# Altium schematic sheet MT8365_CONN.SchDoc
size A3; SheetNumber: 8; SheetTotal: 35
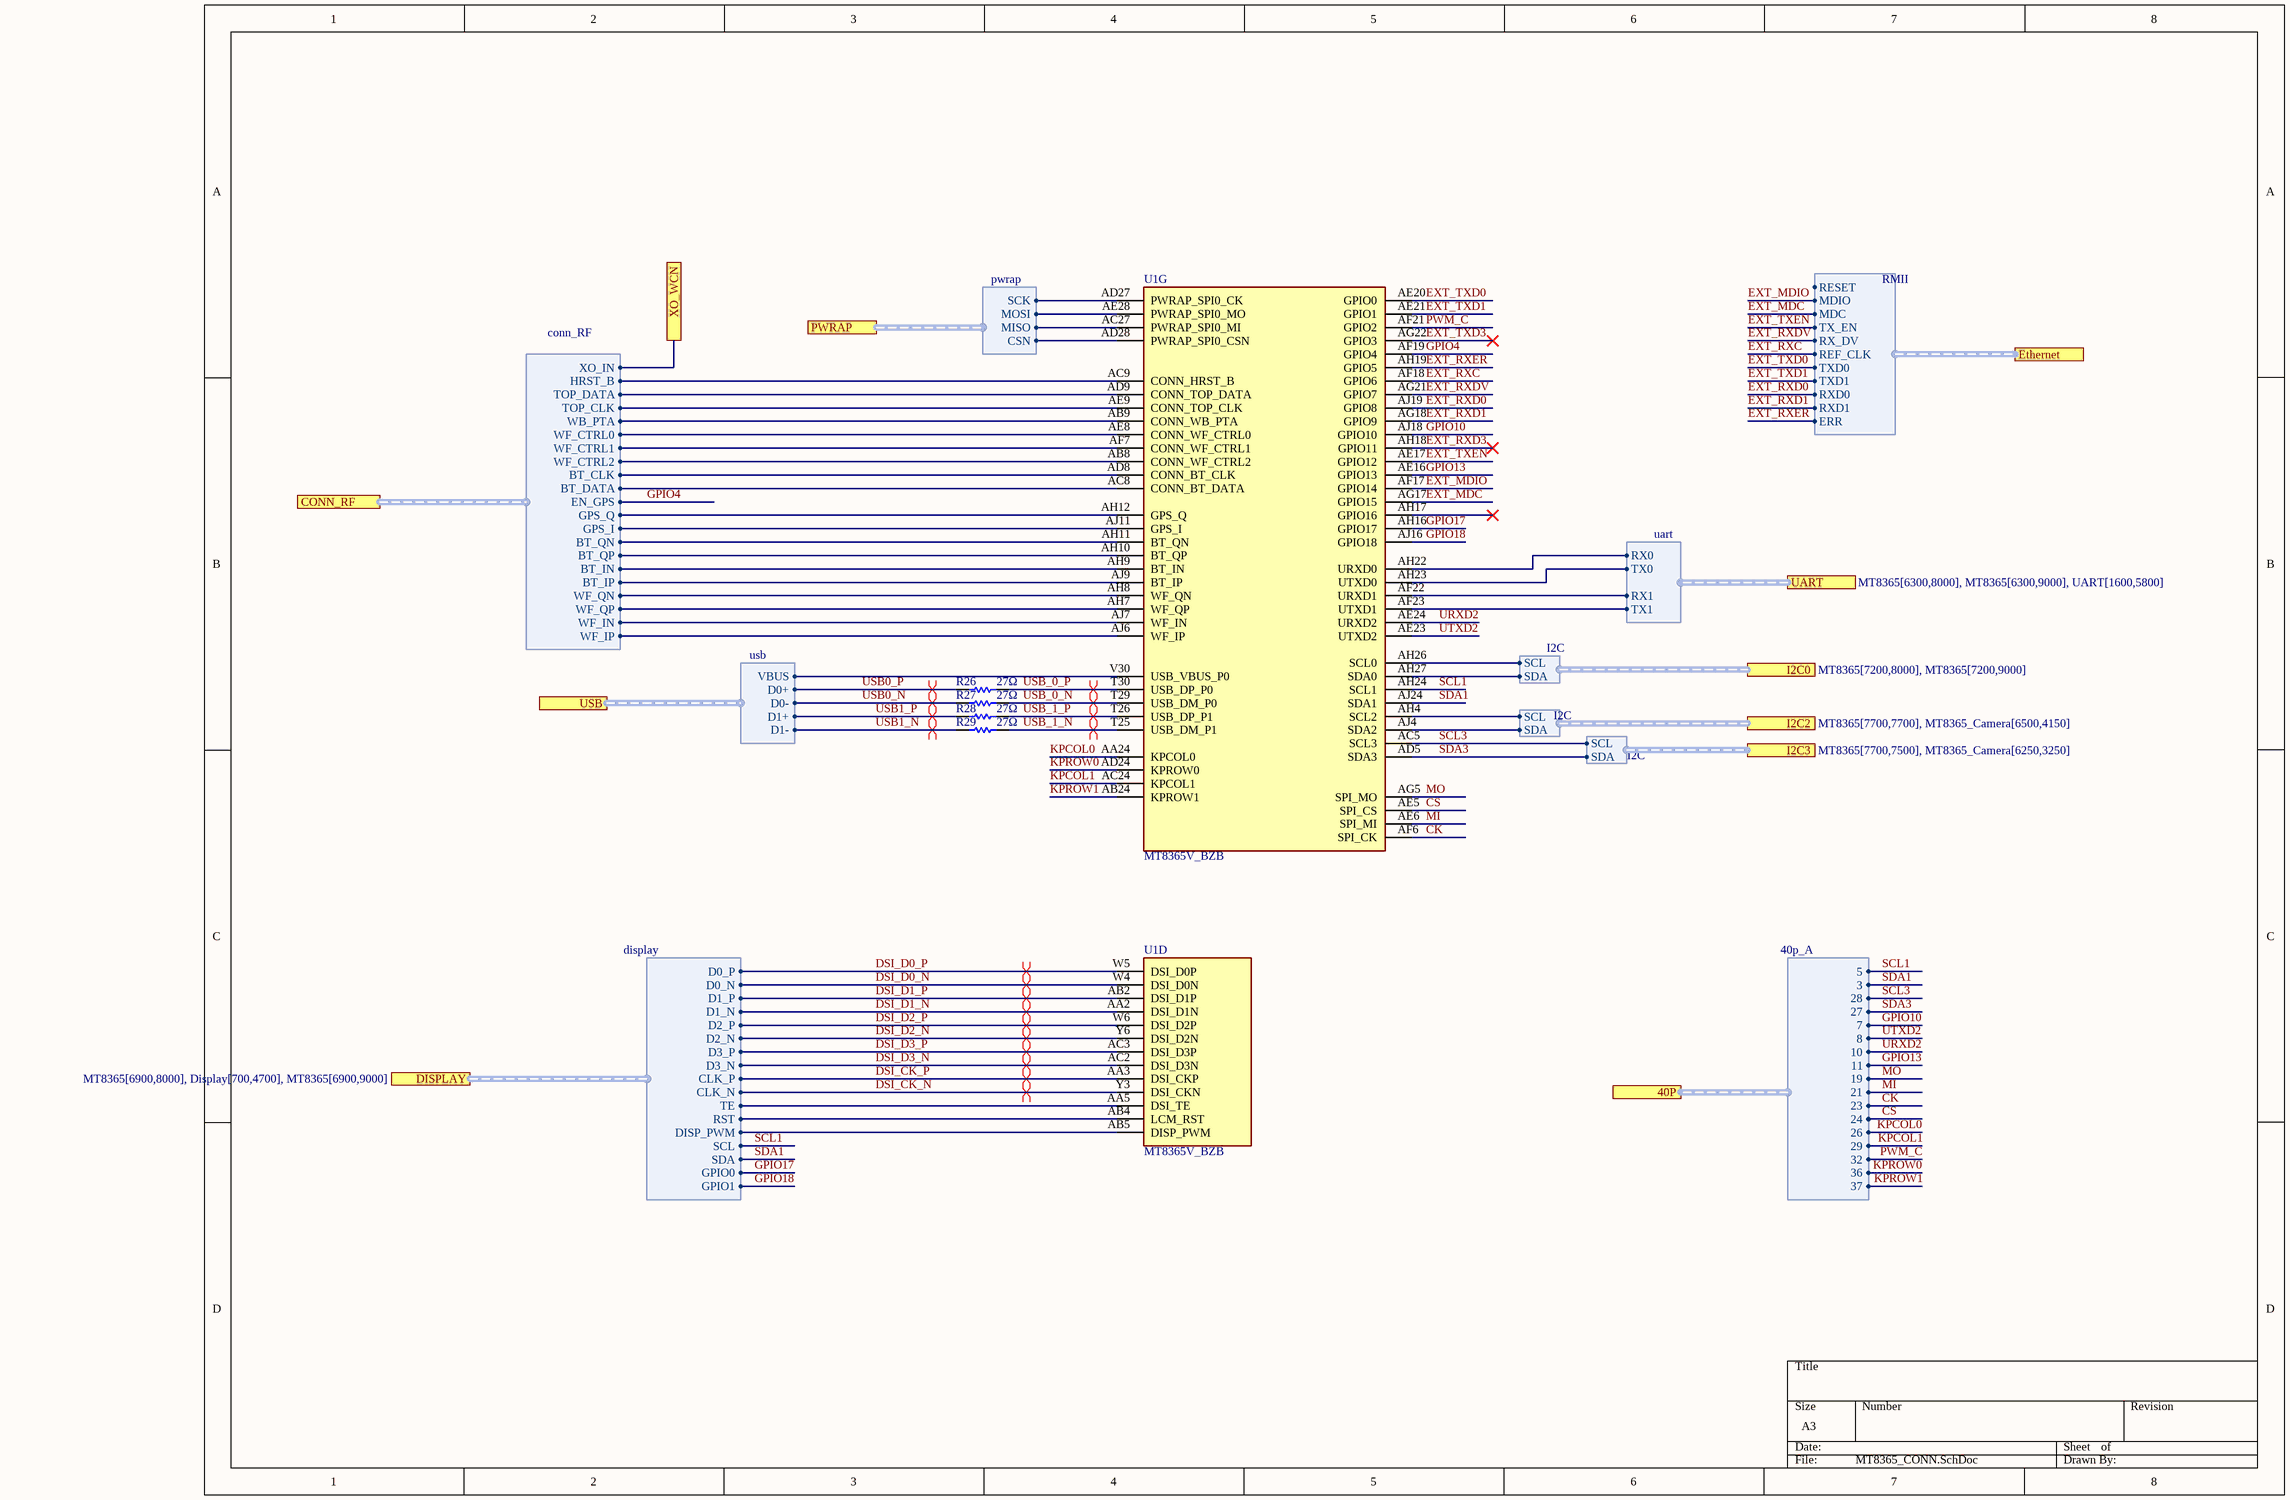
[diagram p0: MT8365_CONN.SchDoc]

## Parts
(Parts that share a designator on the sheet are numbered #1, #2 ... from top to bottom, then left to right.)
R26  value 27Ω  [R0603]  (hidden comment: R0603)
R27  value 27Ω  [R0603]  (hidden comment: R0603)
R28  value 27Ω  [R0603]  (hidden comment: R0603)
R29  value 27Ω  [R0603]  (hidden comment: R0603)
U1#1  MT8365V_BZB  [BGA633C40P30X29_1220X1180X90]  (part G of 10)
U1#2  MT8365V_BZB  [BGA633C40P30X29_1220X1180X90]  (part D of 11)

## Ports
40P (harness 40p_A, see MT8365[7500,8000], GPIOs[500,5200], MT8365[4600,3000], MT8365[7500,8900], MT8365[10000,5500], MT8365_AUD[3500,5200], MT8365_eMMC[8900,5600]), CONN_RF (harness conn_RF, see MT8365[5700,8000], MT6631[10400,3000], MT8365[5700,9000]), DISPLAY (harness display, see MT8365[6900,8000], Display[700,4700], MT8365[6900,9000]), Ethernet (harness RMII, see MT8365[6000,8000], MT8365[6000,9000], RTL8201F[9500,2400]), I2C0 (harness I2C, see MT8365[7200,8000], MT8365[7200,9000]), I2C2 (harness I2C, see MT8365[7700,7700], MT8365_Camera[6500,4150]), I2C3 (harness I2C, see MT8365[7700,7500], MT8365_Camera[6250,3250]), PWRAP (harness pwrap, see MT8365[5500,8000], Control_Interface[3900,4400], MT8365[5500,9000], Power[9100,9000]), UART (harness uart, see MT8365[6300,8000], MT8365[6300,9000], UART[1600,5800]), USB (harness usb, see MT8365[6600,8000], MT8365[6600,9000], USB[700,4700]), XO_WCN (see MT8365[7700,7300], MT8365_Other[3700,4800])

## Harnesses
pwrap: SCK, MOSI, MISO, CSN
conn_RF: XO_IN, HRST_B, TOP_DATA, TOP_CLK, WB_PTA, WF_CTRL0, WF_CTRL1, WF_CTRL2, BT_CLK, BT_DATA, GPS_Q, GPS_I, BT_QN, BT_QP, BT_IN, BT_IP, WF_QN, WF_QP, WF_IN, WF_IP, EN_GPS
RMII: MDIO, MDC, TX_EN, RX_DV, REF_CLK, TXD0, TXD1, RXD0, RXD1, RESET, ERR
uart: TX0, RX0, TX1, RX1
usb: D0+, D0-, D1+, D1-, VBUS
I2C: SCL, SDA
display: D0_P, D0_N, D1_P, D1_N, D2_P, D2_N, D3_P, D3_N, CLK_P, CLK_N, TE, RST, DISP_PWM, SCL, SDA, GPIO0, GPIO1
40p_A: 7, 8, 10, 11, 19, 21, 23, 24, 26, 29, 32, 36, 37, 5, 3, 28, 27

## Nets
CK: U1#1.AF6(SPI_CK) ; port 40P.23
CS: U1#1.AE5(SPI_CS) ; port 40P.24
DSI_CK_N: U1#2.Y3(DSI_CKN) ; port DISPLAY.CLK_N
DSI_CK_P: U1#2.AA3(DSI_CKP) ; port DISPLAY.CLK_P
DSI_D0_N: U1#2.W4(DSI_D0N) ; port DISPLAY.D0_N
DSI_D0_P: U1#2.W5(DSI_D0P) ; port DISPLAY.D0_P
DSI_D1_N: U1#2.AA2(DSI_D1N) ; port DISPLAY.D1_N
DSI_D1_P: U1#2.AB2(DSI_D1P) ; port DISPLAY.D1_P
DSI_D2_N: U1#2.Y6(DSI_D2N) ; port DISPLAY.D2_N
DSI_D2_P: U1#2.W6(DSI_D2P) ; port DISPLAY.D2_P
DSI_D3_N: U1#2.AC2(DSI_D3N) ; port DISPLAY.D3_N
DSI_D3_P: U1#2.AC3(DSI_D3P) ; port DISPLAY.D3_P
EXT_MDC: U1#1.AG17(GPIO15) ; port Ethernet.MDC
EXT_MDIO: U1#1.AF17(GPIO14) ; port Ethernet.MDIO
EXT_RXC: U1#1.AF18(GPIO6) ; port Ethernet.REF_CLK
EXT_RXD0: U1#1.AJ19(GPIO8) ; port Ethernet.RXD0
EXT_RXD1: U1#1.AG18(GPIO9) ; port Ethernet.RXD1
EXT_RXD3: U1#1.AH18(GPIO11)
EXT_RXDV: U1#1.AG21(GPIO7) ; port Ethernet.RX_DV
EXT_RXER: U1#1.AH19(GPIO5) ; port Ethernet.ERR
EXT_TXD0: U1#1.AE20(GPIO0) ; port Ethernet.TXD0
EXT_TXD1: U1#1.AE21(GPIO1) ; port Ethernet.TXD1
EXT_TXD3: U1#1.AG22(GPIO3)
EXT_TXEN: U1#1.AE17(GPIO12) ; port Ethernet.TX_EN
GPIO4: U1#1.AF19(GPIO4) ; port CONN_RF.EN_GPS
GPIO10: U1#1.AJ18(GPIO10) ; port 40P.7
GPIO13: U1#1.AE16(GPIO13) ; port 40P.11
GPIO17: U1#1.AH16(GPIO17) ; port DISPLAY.GPIO0
GPIO18: U1#1.AJ16(GPIO18) ; port DISPLAY.GPIO1
KPCOL0: U1#1.AA24(KPCOL0) ; port 40P.26
KPCOL1: U1#1.AC24(KPCOL1) ; port 40P.29
KPROW0: U1#1.AD24(KPROW0) ; port 40P.36
KPROW1: U1#1.AB24(KPROW1) ; port 40P.37
MI: U1#1.AE6(SPI_MI) ; port 40P.21
MO: U1#1.AG5(SPI_MO) ; port 40P.19
PWM_C: U1#1.AF21(GPIO2) ; port 40P.32
SCL1: U1#1.AH24(SCL1) ; port DISPLAY.SCL, port 40P.5
SCL3: U1#1.AC5(SCL3) ; port I2C3.SCL, port 40P.28
SDA1: U1#1.AJ24(SDA1) ; port DISPLAY.SDA, port 40P.3
SDA3: U1#1.AD5(SDA3) ; port I2C3.SDA, port 40P.27
URXD2: U1#1.AE24(URXD2) ; port 40P.10
USB0_N: R27.1 ; port USB.D0-
USB0_P: R26.1 ; port USB.D0+
USB1_N: R29.1 ; port USB.D1-
USB1_P: R28.1 ; port USB.D1+
USB_0_N: R27.2 U1#1.T29(USB_DM_P0)
USB_0_P: R26.2 U1#1.T30(USB_DP_P0)
USB_1_N: R29.2 U1#1.T25(USB_DM_P1)
USB_1_P: R28.2 U1#1.T26(USB_DP_P1)
UTXD2: U1#1.AE23(UTXD2) ; port 40P.8
XO_WCN: port XO_WCN, port CONN_RF.XO_IN
NetU1#1_AB8: U1#1.AB8(CONN_WF_CTRL2) ; port CONN_RF.WF_CTRL2
NetU1#1_AB9: U1#1.AB9(CONN_WB_PTA) ; port CONN_RF.WB_PTA
NetU1#1_AC8: U1#1.AC8(CONN_BT_DATA) ; port CONN_RF.BT_DATA
NetU1#1_AC9: U1#1.AC9(CONN_HRST_B) ; port CONN_RF.HRST_B
NetU1#1_AC27: U1#1.AC27(PWRAP_SPI0_MI) ; port PWRAP.MISO
NetU1#1_AD8: U1#1.AD8(CONN_BT_CLK) ; port CONN_RF.BT_CLK
NetU1#1_AD9: U1#1.AD9(CONN_TOP_DATA) ; port CONN_RF.TOP_DATA
NetU1#1_AD27: U1#1.AD27(PWRAP_SPI0_CK) ; port PWRAP.SCK
NetU1#1_AD28: U1#1.AD28(PWRAP_SPI0_CSN) ; port PWRAP.CSN
NetU1#1_AE8: U1#1.AE8(CONN_WF_CTRL0) ; port CONN_RF.WF_CTRL0
NetU1#1_AE9: U1#1.AE9(CONN_TOP_CLK) ; port CONN_RF.TOP_CLK
NetU1#1_AE28: U1#1.AE28(PWRAP_SPI0_MO) ; port PWRAP.MOSI
NetU1#1_AF7: U1#1.AF7(CONN_WF_CTRL1) ; port CONN_RF.WF_CTRL1
NetU1#1_AF22: U1#1.AF22(URXD1) ; port UART.RX1
NetU1#1_AF23: U1#1.AF23(UTXD1) ; port UART.TX1
NetU1#1_AH4: U1#1.AH4(SCL2) ; port I2C2.SCL
NetU1#1_AH7: U1#1.AH7(WF_QP) ; port CONN_RF.WF_QP
NetU1#1_AH8: U1#1.AH8(WF_QN) ; port CONN_RF.WF_QN
NetU1#1_AH9: U1#1.AH9(BT_IN) ; port CONN_RF.BT_IN
NetU1#1_AH10: U1#1.AH10(BT_QP) ; port CONN_RF.BT_QP
NetU1#1_AH11: U1#1.AH11(BT_QN) ; port CONN_RF.BT_QN
NetU1#1_AH12: U1#1.AH12(GPS_Q) ; port CONN_RF.GPS_Q
NetU1#1_AH22: U1#1.AH22(URXD0) ; port UART.RX0
NetU1#1_AH23: U1#1.AH23(UTXD0) ; port UART.TX0
NetU1#1_AH26: U1#1.AH26(SCL0) ; port I2C0.SCL
NetU1#1_AH27: U1#1.AH27(SDA0) ; port I2C0.SDA
NetU1#1_AJ4: U1#1.AJ4(SDA2) ; port I2C2.SDA
NetU1#1_AJ6: U1#1.AJ6(WF_IP) ; port CONN_RF.WF_IP
NetU1#1_AJ7: U1#1.AJ7(WF_IN) ; port CONN_RF.WF_IN
NetU1#1_AJ9: U1#1.AJ9(BT_IP) ; port CONN_RF.BT_IP
NetU1#1_AJ11: U1#1.AJ11(GPS_I) ; port CONN_RF.GPS_I
NetU1#1_V30: U1#1.V30(USB_VBUS_P0) ; port USB.VBUS
NetU1#2_AA5: U1#2.AA5(DSI_TE) ; port DISPLAY.TE
NetU1#2_AB4: U1#2.AB4(LCM_RST) ; port DISPLAY.RST
NetU1#2_AB5: U1#2.AB5(DISP_PWM) ; port DISPLAY.DISP_PWM

Not connected (* = marked no-connect by the designer): U1#1 AH17(GPIO16)*

## Layout directives
differential pair: DSI_CK_N, DSI_CK_P, DSI_D0_N, DSI_D0_P, DSI_D1_N, DSI_D1_P, DSI_D2_N, DSI_D2_P, DSI_D3_N, DSI_D3_P, USB0_N, USB0_P, USB1_N, USB1_P, USB_0_N, USB_0_P, USB_1_N, USB_1_P

## Library data of the parts
U1#1 = MT8365V_BZB: SoC; Manufacturer_Name: Mediatek; Manufacturer_Part_Number: MT8365V/BZB; Datasheet Link: https://www.mouser.co.uk/datasheet/2/1074/MT8365_AIoT_Application_Processor_Datasheet_v1_0_2-3106631.pdf; Height: 0.9mm; Mouser Part Number: 840-MT8365V/BZB; Mouser Price/Stock: https://www.mouser.co.uk/ProductDetail/MediaTek/MT8365V-BZB?qs=Jm2GQyTW%2FbjcedX9ugwNWQ%3D%3D
U1#2 = MT8365V_BZB: Integrated Circuit; Manufacturer_Name: Mediatek; Manufacturer_Part_Number: MT8365V/BZB; Datasheet Link: https://www.mouser.co.uk/datasheet/2/1074/MT8365_AIoT_Application_Processor_Datasheet_v1_0_2-3106631.pdf; Height: 0.9mm; Mouser Part Number: 840-MT8365V/BZB; Mouser Price/Stock: https://www.mouser.co.uk/ProductDetail/MediaTek/MT8365V-BZB?qs=Jm2GQyTW%2FbjcedX9ugwNWQ%3D%3D